# Altium schematic sheet POWER&RTC.SchDoc
size A3; Revision: 1.0; SheetNumber: 3; SheetTotal: 7
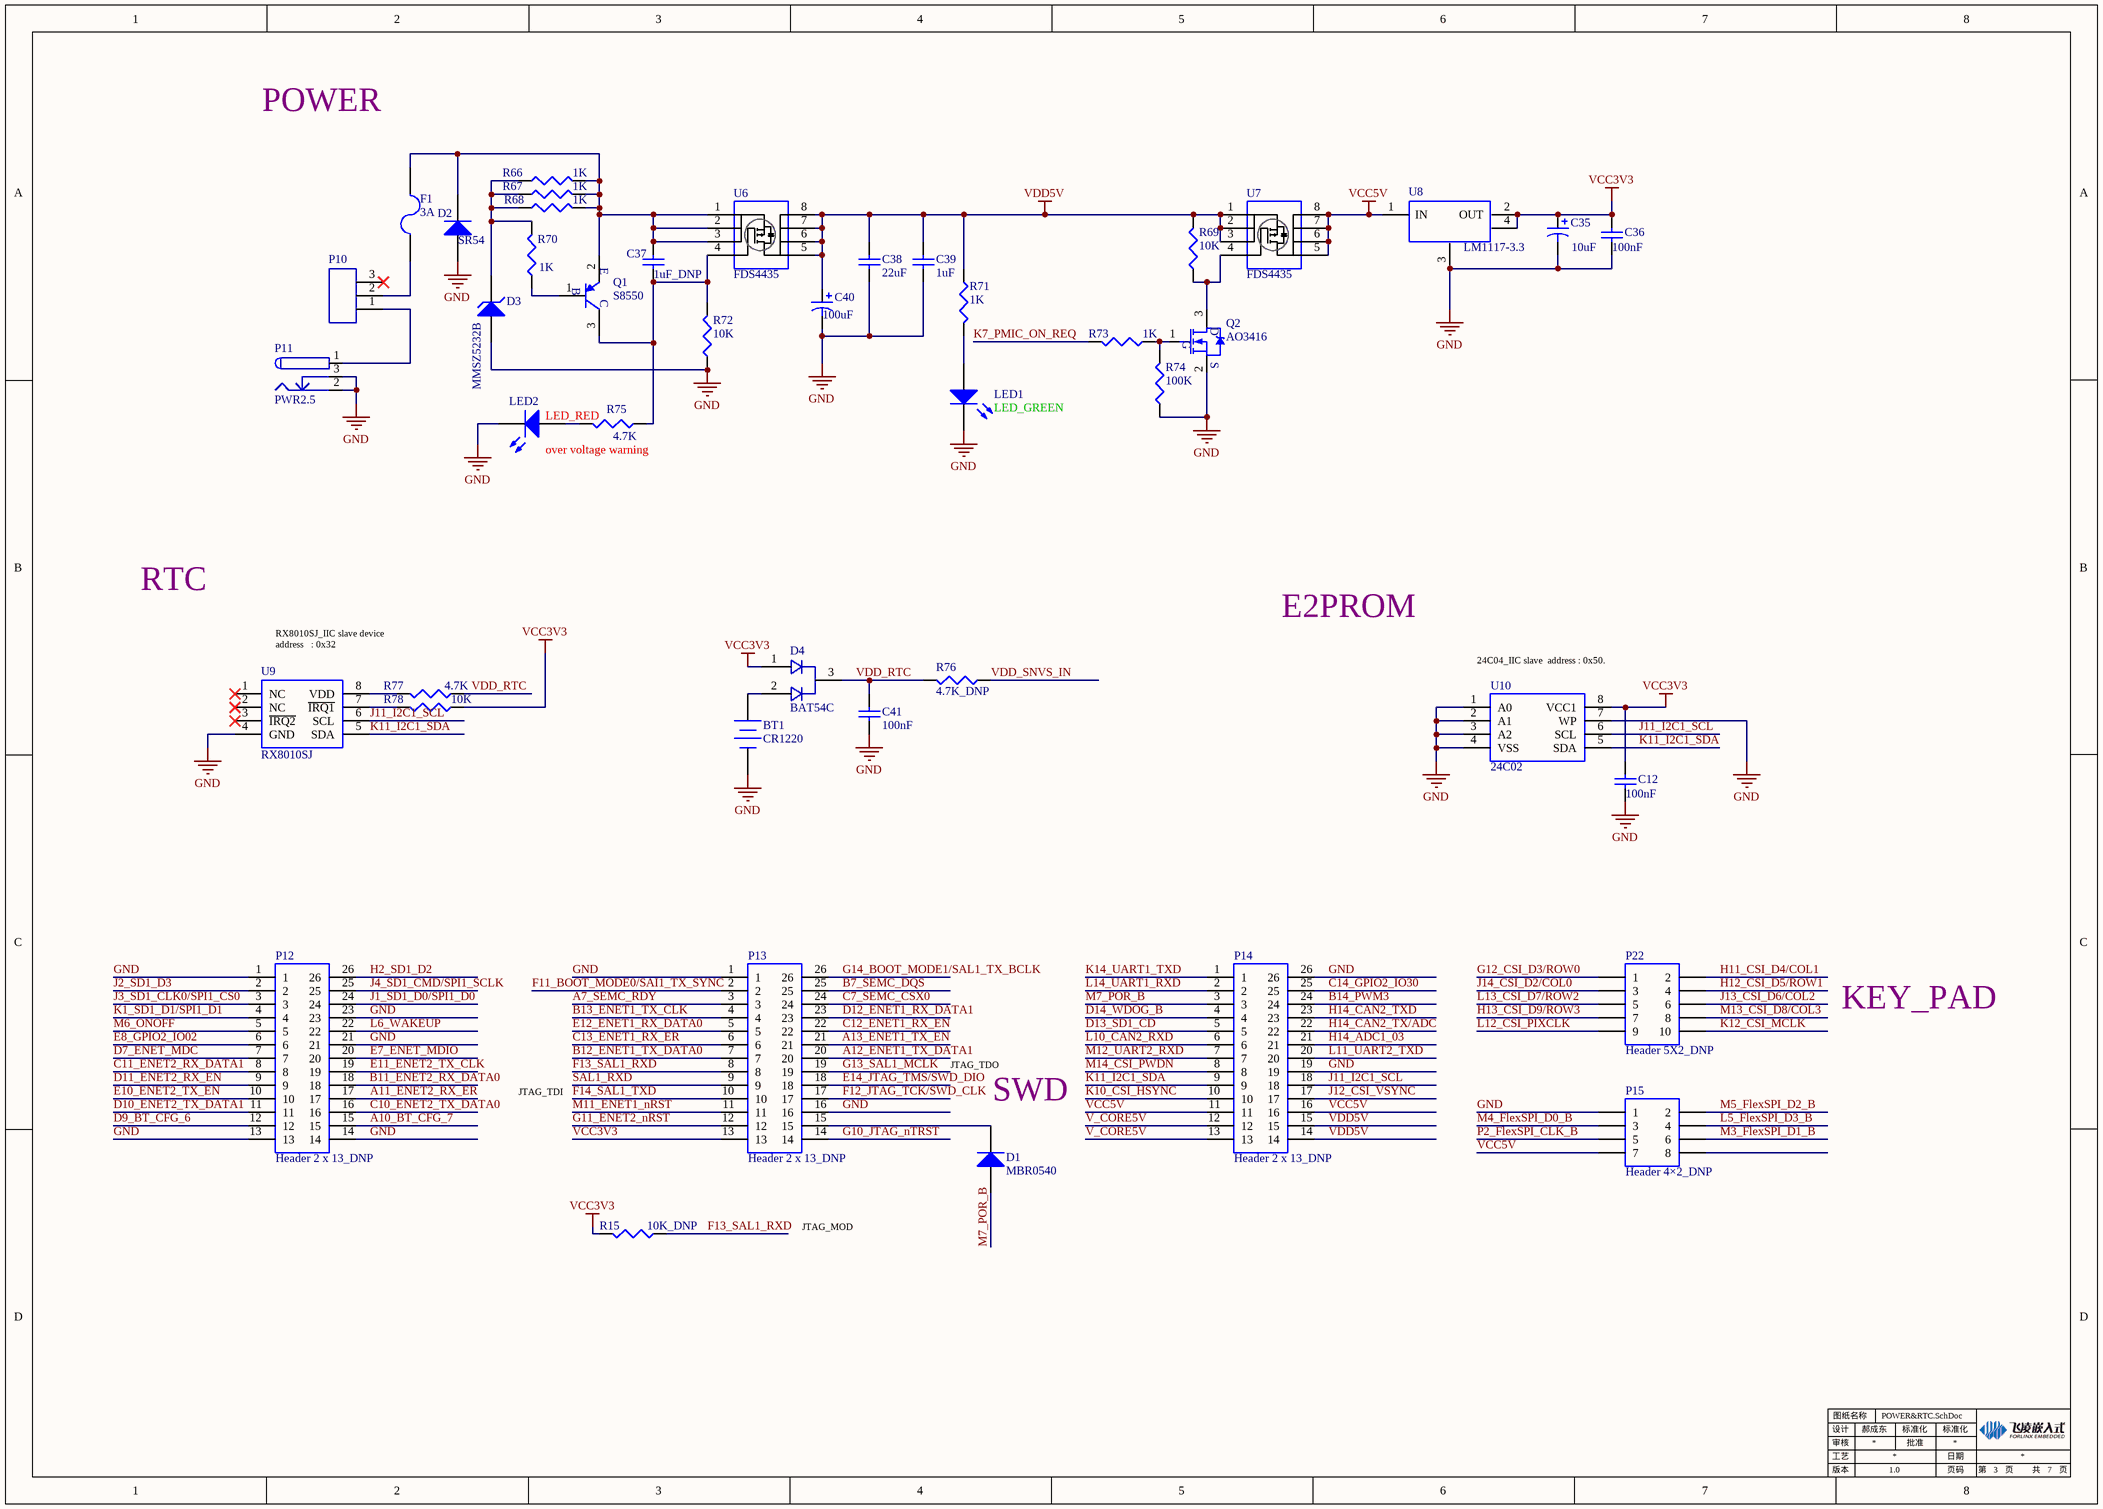
[diagram p0: POWER&RTC.SchDoc]

## Parts
BT1  CR1220  [BH-1220 BATTERY]
C12  100nF  [0603C+]
C35  10uF  [TC3216A]
C36  100nF  [0603C+]
C37  1uF_DNP  [0603C+]
C38  22uF  [0603C+]
C39  1uF  [0603C+]
C40  100uF  [TC3528B]
C41  100nF  [0603C+]
D1  MBR0540  [Diode1.6*2.6]
D2  SR54  [SMB/DO-214AA]
D3  MMSZ5232B  [Diode1.6*2.6]
D4  BAT54C  [SOT23]
F1  3A  [R_1210]
LED1  LED_GREEN  [LED0603_M1608]
LED2  LED_RED  [LED0603_M1608]
P10  P18  [SW01]  (value not drawn)
P11  PWR2.5  [JACK-2.5MM_B]
P12  Header 2 x 13_DNP  [HDR2X13]
P13  Header 2 x 13_DNP  [HDR2X13]
P14  Header 2 x 13_DNP  [HDR2X13]
P15  Header 4×2_DNP  [HDR2X4]
P22  Header 5X2_DNP  [HDR2X5]
Q1  S8550  [SOT95P245X110-3N]
Q2  AO3416  [SOT95P245X110-3N]
R15  10K_DNP  [0603R+]
R66  1K  [0603R+]
R67  1K  [0603R+]
R68  1K  [0603R+]
R69  10K  [0603R+]
R70  1K  [0603R+]
R71  1K  [0603R+]
R72  10K  [0603R+]
R73  1K  [0603R+]
R74  100K  [0603R+]
R75  4.7K  [0603R+]
R76  4.7K_DNP  [0603R+]
R77  4.7K  [0603R+]
R78  10K  [0603R+]
U6  FDS4435  [FDS4435]
U7  FDS4435  [FDS4435]
U8  LM1117-3.3  [LM1117]
U9  RX8010SJ  [RX8010SJ]
U10  24C02  [24C04_SO8]

## Nets
GND: BT1.2(-) C12.1 C35.2 C36.1 C38.2 C39.2 C40.2 C41.1 D2.1(A) D3.1(A) LED1.2(K) LED2.2(K) P11.2(ADJ) P11.3(ADJ) P12.1 P12.13 P12.14 P12.21 P12.23 P13.1 P13.16 P14.19 P14.26 P15.1 Q2.2(S) R72.1 R74.1 U8.3(GND) U9.4(GND) U10.1(A0) U10.2(A1) U10.3(A2) U10.4(VSS) U10.7(WP)
VCC3V3: C12.2 C35.1 C36.2 D4.1 P13.13 R15.2 R78.1 U8.2(OUT) U8.4 U10.8(VCC1)
VCC5V: P14.11 P14.16 P15.7 U7.5(D) U7.6(D) U7.7(D) U7.8(D) U8.1(IN)
VDD5V: C38.1 C39.1 C40.1 P14.14 P14.15 R69.2 R71.1 U6.5(D) U6.6(D) U6.7(D) U6.8(D) U7.1(S) U7.2(S) U7.3(S)
A7_SEMC_RDY: P13.3
A10_BT_CFG_7: P12.15
A11_ENET2_RX_ER: P12.17
A12_ENET1_TX_DATA1: P13.20
A13_ENET1_TX_EN: P13.21
B7_SEMC_DQS: P13.25
B11_ENET2_RX_DATA0: P12.18
B12_ENET1_TX_DATA0: P13.7
B13_ENET1_TX_CLK: P13.4
B14_PWM3: P14.24
C7_SEMC_CSX0: P13.24
C10_ENET2_TX_DATA0: P12.16
C11_ENET2_RX_DATA1: P12.8
C12_ENET1_RX_EN: P13.22
C13_ENET1_RX_ER: P13.6
C14_GPIO2_IO30: P14.25
D7_ENET_MDC: P12.7
D9_BT_CFG_6: P12.12
D10_ENET2_TX_DATA1: P12.11
D11_ENET2_RX_EN: P12.9
D12_ENET1_RX_DATA1: P13.23
D13_SD1_CD: P14.5
D14_WDOG_B: P14.4
E7_ENET_MDIO: P12.20
E8_GPIO2_IO02: P12.6
E10_ENET2_TX_EN: P12.10
E11_ENET2_TX_CLK: P12.19
E12_ENET1_RX_DATA0: P13.5
E14_JTAG_TMS/SWD_DIO: P13.18
F11_BOOT_MODE0/SAI1_TX_SYNC: P13.2
F12_JTAG_TCK/SWD_CLK: P13.17
F13_SAL1_RXD: P13.8 R15.1
F14_SAL1_TXD: P13.10
G10_JTAG_nTRST: P13.14
G11_ENET2_nRST: P13.12
G12_CSI_D3/ROW0: P22.1
G13_SAL1_MCLK: P13.19
G14_BOOT_MODE1/SAL1_TX_BCLK: P13.26
H2_SD1_D2: P12.26
H11_CSI_D4/COL1: P22.2
H12_CSI_D5/ROW1: P22.4
H13_CSI_D9/ROW3: P22.7
H14_ADC1_03: P14.21
H14_CAN2_TX/ADC: P14.22
H14_CAN2_TXD: P14.23
J1_SD1_D0/SPI1_D0: P12.24
J2_SD1_D3: P12.2
J3_SD1_CLK0/SPI1_CS0: P12.3
J4_SD1_CMD/SPI1_SCLK: P12.25
J11_I2C1_SCL: P14.18 U9.6(SCL) U10.6(SCL)
J12_CSI_VSYNC: P14.17
J13_CSI_D6/COL2: P22.6
J14_CSI_D2/COL0: P22.3
K1_SD1_D1/SPI1_D1: P12.4
K7_PMIC_ON_REQ: R73.2
K10_CSI_HSYNC: P14.10
K11_I2C1_SDA: P14.9 U9.5(SDA) U10.5(SDA)
K12_CSI_MCLK: P22.10
K14_UART1_TXD: P14.1
L5_FlexSPI_D3_B: P15.4
L6_WAKEUP: P12.22
L10_CAN2_RXD: P14.6
L11_UART2_TXD: P14.20
L12_CSI_PIXCLK: P22.9
L13_CSI_D7/ROW2: P22.5
L14_UART1_RXD: P14.2
M3_FlexSPI_D1_B: P15.6
M4_FlexSPI_D0_B: P15.3
M5_FlexSPI_D2_B: P15.2
M6_ONOFF: P12.5
M7_POR_B: D1.1(A) P14.3
M11_ENET1_nRST: P13.11
M12_UART2_RXD: P14.7
M13_CSI_D8/COL3: P22.8
M14_CSI_PWDN: P14.8
P2_FlexSPI_CLK_B: P15.5
SAL1_RXD: P13.9
V_CORE5V: P14.12 P14.13
VDD_RTC: C41.2 D4.3 R76.2 R77.1
VDD_SNVS_IN: R76.1
NetBT1_1: BT1.1(+) D4.2
NetC37_1: C37.1 D2.2(K) F1.2 Q1.2(E) R66.2 R67.2 R68.2 U6.1(S) U6.2(S) U6.3(S)
NetC37_2: C37.2 Q1.3(C) R72.2 R75.1 U6.4(G)
NetD1_2: D1.2(K) P13.15
NetD3_2: D3.2(K) R66.1 R67.1 R68.1 R70.2
NetF1_1: F1.1 P10.2(DQ17)
NetLED1_1: LED1.1(A) R71.2
NetLED2_1: LED2.1(A) R75.2
NetP10_1: P10.1(DQ16) P11.1(ADJ)
NetQ1_1: Q1.1(B) R70.1
NetQ2_1: Q2.1(G) R73.1 R74.2
NetQ2_3: Q2.3(D) R69.1 U7.4(G)
NetR77_2: R77.2 U9.8(VDD)
NetR78_2: R78.2 U9.7(~{IRQ1})

Not connected (* = marked no-connect by the designer): P10 3(DQ18)*; P15 8; U9 1(NC)* 2(NC)* 3(~{IRQ2})*

## Notes on the sheet
- POWER
- over voltage warning
- RTC
- RX8010SJ_IIC slave device address   : 0x32
- E2PROM
- (near U10) 24C04_IIC slave  address : 0x50.
- KEY_PAD
- JTAG_TDI
- JTAG_TDO
- (near D1) SWD
- JTAG_MOD
- 设计
- 审核
- 工艺
- 图纸名称
- 郝成东
- 批准
- 标准化
- 日期
- 版本
- 页码
- 第
- 页
- 共

## Library data of the parts
BT1 = Battery: Multicell Battery; Published: 24-Mar-1999; LatestRevisionDate: 17-Jul-2002; LatestRevisionNote: Re-released for DXP Platform.; PackageReference: BAT-2; Publisher: Altium Limited; PackageDescription: Battery; 2 Leads
C12 C36 = CAP: Capacitor; Value: 100nF; Published: 8-Jun-2000; LatestRevisionDate: 17-Jul-2002; LatestRevisionNote: Re-released for DXP Platform.; PackageReference: RAD-0.3; Publisher: Altium Limited; PackageDescription: Radial Cap, Thru-Hole; 2 Leads; 0.3 in Pin Spacing
C35 C40 = Cap Pol1: Polarized Capacitor (Radial); Published: 8-Jun-2000; LatestRevisionDate: 17-Jul-2002; LatestRevisionNote: Re-released for DXP Platform.; PackageReference: RB7.6-15; Publisher: Altium Limited; PackageDescription: Polarized Capacitor (Radial); 2 Leads
  C35: Value: 10uF
  C40: Value: 100uF
C37-C39 C41 = Cap: Capacitor; Published: 8-Jun-2000; LatestRevisionDate: 17-Jul-2002; LatestRevisionNote: Re-released for DXP Platform.; PackageReference: RAD-0.3; Publisher: Altium Limited; PackageDescription: Radial Cap, Thru-Hole; 2 Leads; 0.3 in Pin Spacing
  C37: Value: 1uF_DNP
  C38: Value: 22uF
  C39: Value: 1uF
  C41: Value: 100nF
D1 D2 = Diode: Default Diode; Published: 8-Jun-2000; LatestRevisionDate: 17-Jul-2002; LatestRevisionNote: Re-released for DXP Platform.; PackageVersion: Sep-1996; PackageReference: SMC; Publisher: Altium Limited; PackageDescription: DO-214-AB/SMC; 2 C-Bend Leads; Body 7.9 x 5.9 mm, inc. leads (LxW); Code_JEDEC: DO-214-AB
D3 = D Zener: Zener Diode; Published: 8-Jun-2000; LatestRevisionDate: 17-Jul-2002; LatestRevisionNote: Re-released for DXP Platform.; PackageReference: DIODE-0.7; Publisher: Altium Limited; PackageDescription: Diode, Thru-Hole; 2 Leads; 0.7 in Pin Spacing
F1 = Fuse 2: Fuse; Published: 8-Jun-2000; LatestRevisionDate: 17-Jul-2002; LatestRevisionNote: Re-released for DXP Platform.; PackageReference: PIN-W2/E2.8; Publisher: Altium Limited; PackageDescription: Thru-Hole; 2 Leads; Value: 3A
LED1 LED2 = LED2: Typical RED, GREEN, YELLOW, AMBER GaAs LED; Published: 8-Jun-2000; LatestRevisionDate: 17-Jul-2002; LatestRevisionNote: Re-released for DXP Platform.; PackageVersion: Feb-2002; PackageReference: 3.2X1.6X1.1; Publisher: Altium Limited; PackageDescription: SM LED; 2 Flat Leads; Value: RED
P10 = CON3
P12-P14 = Header 2 x 13
P15 = Header 4×2
P22 = Header 5X2: Header, 5-Pin, Dual row; LatestRevisionDate: 17-Jul-2002; LatestRevisionNote: Re-released for DXP Platform.; Publisher: Altium Limited
Q1 = PNP: NPN Bipolar Transistor; Published: 8-Jun-2000; LatestRevisionDate: 17-Jul-2002; LatestRevisionNote: Re-released for DXP Platform.; PackageReference: TO-226-AA; Publisher: Altium Limited; PackageDescription: TO, Flat Index; 3 In-Line, Axial Leads; Body Dia. 4.8mm; Leads 0.55 x 0.51 mm (max); Code_JEDEC: TO-226-AA; VALUE: S8550
Q2 = NMOS: N-Channel Power MOSFET; Note: Pin 2 is electrically connected to pin 4.; Published: 8-Jun-2000; LatestRevisionDate: 17-Jul-2002; LatestRevisionNote: Re-released for DXP Platform.; DatasheetVersion: PD-9.814; PackageVersion: Feb-1997; PackageReference: TO-220AB; Publisher: Altium Limited; PackageDescription: TO, Thru-Hole, Vertical, Heatsink Mounted; 3 In-Line Leads; Pitch 2.54 mm; ComponentLink1Description: Manufacturer Link; ComponentLink1URL: http://www.irf.com/; VALUE: AO3416
R15 R66-R78 = Res3: Resistor; Published: 8-Jun-2000; LatestRevisionDate: 29-May-2009; LatestRevisionNote: IPC-7351 Footprint Added.; PackageReference: J1-0603; Publisher: Altium Limited; PackageDescription: Chip Resistor
  R15: Value: 10K_DNP
  R66-R68 R70 R71 R73: Value: 1K
  R69 R72 R78: Value: 10K
  R74: Value: 100K
  R75 R77: Value: 4.7K
  R76: Value: 4.7K_DNP
U8 = LM1117: Value: LM1117-3.3
U10 = 24C04_SO8
D4 = BAT54C: Value: BAT54C
U9 = RX8010SJ: Value: RX8010SJ